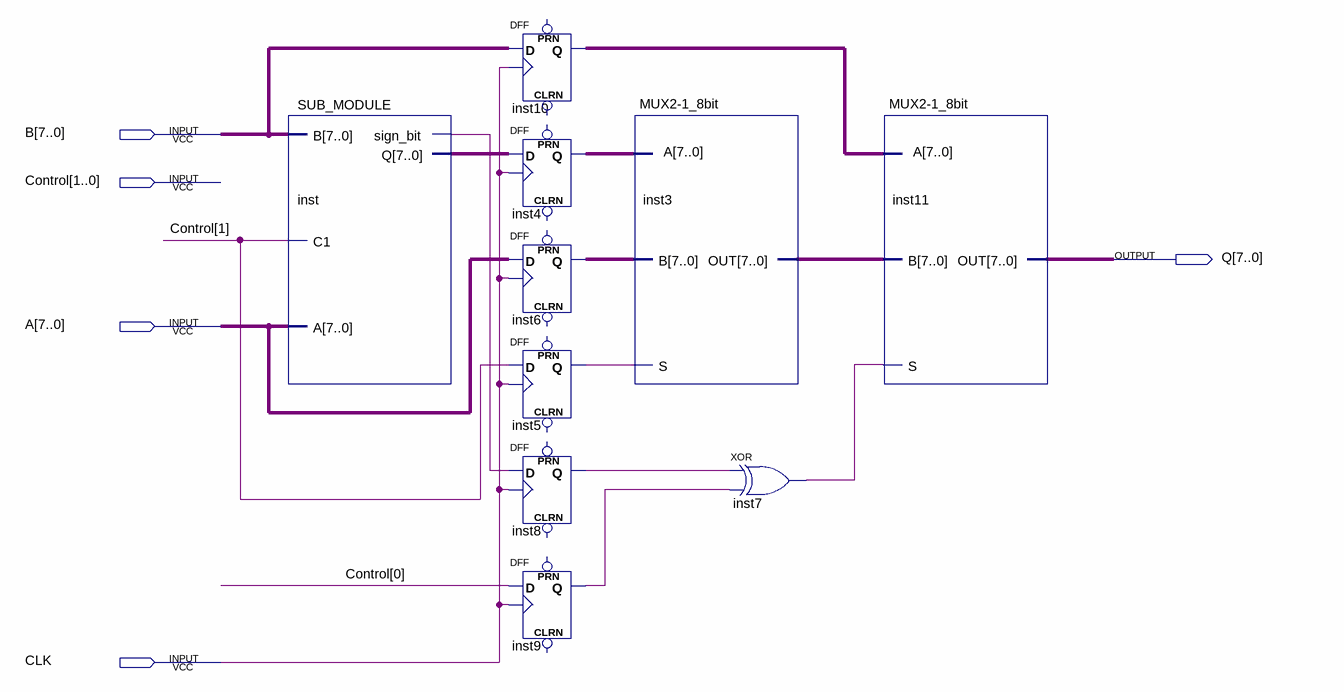
[diagram p0: schematic sheet]
// Quartus schematic AU_1.bdf as structural Verilog: 10 symbols, 5 pins
module AU_1 (
  input  [7:0] B,
  input  [1:0] Control,
  input  [7:0] A,
  input  CLK,
  output [7:0] Q
);

  wire inst5_q, inst7_out, inst8_q, inst9_q, inst_sign_bit;
  wire [7:0] inst3_out, inst4_q, inst6_q, inst10_q, inst_q;

  SUB_MODULE inst (.B(B), .A(A), .C1(Control[1]), .sign_bit(inst_sign_bit), .Q(inst_q));
  DFF inst10[7:0] (.CLK(CLK), .D(B), .Q(inst10_q));  // open: CLRN, PRN
  DFF inst4[7:0] (.CLK(CLK), .D(inst_q), .Q(inst4_q));  // open: CLRN, PRN
  DFF inst6[7:0] (.CLK(CLK), .D(A), .Q(inst6_q));  // open: CLRN, PRN
  DFF inst5 (.CLK(CLK), .D(Control[1]), .Q(inst5_q));  // open: CLRN, PRN
  DFF inst8 (.CLK(CLK), .D(inst_sign_bit), .Q(inst8_q));  // open: CLRN, PRN
  DFF inst9 (.CLK(CLK), .D(Control[0]), .Q(inst9_q));  // open: CLRN, PRN
  \MUX2-1_8bit  inst3 (.S(inst5_q), .A(inst4_q), .B(inst6_q), .OUT(inst3_out));
  xor inst7 (inst7_out, inst8_q, inst9_q);
  \MUX2-1_8bit  inst11 (.S(inst7_out), .A(inst10_q), .B(inst3_out), .OUT(Q));
endmodule
